# EAGLE board GSM Playground V1_6 (EAGLE 5.06)
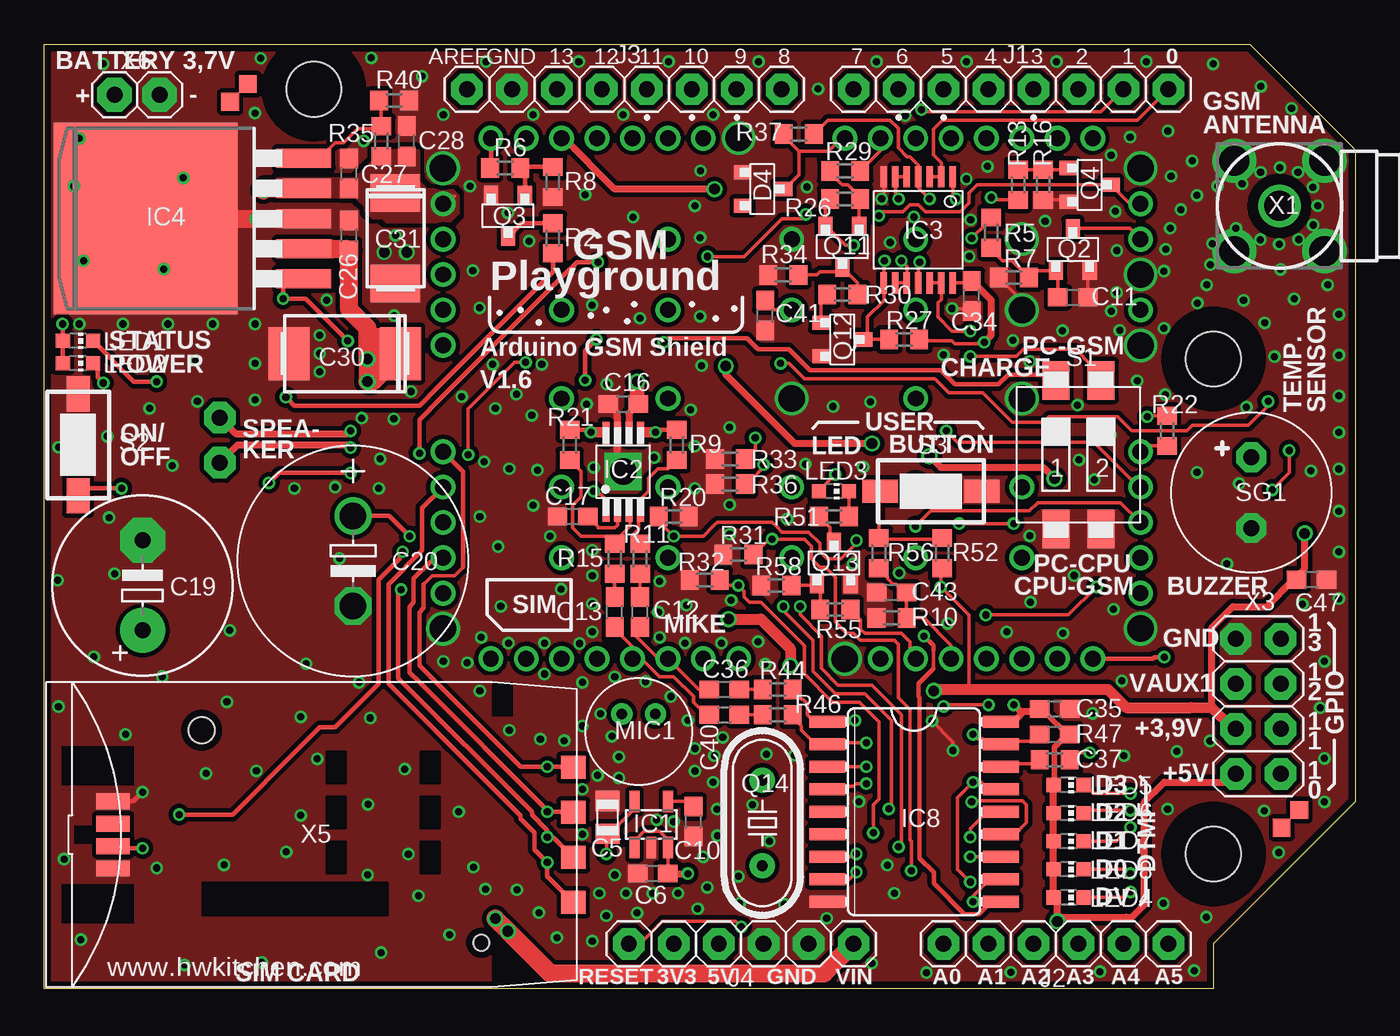
[diagram p1: board, top side]
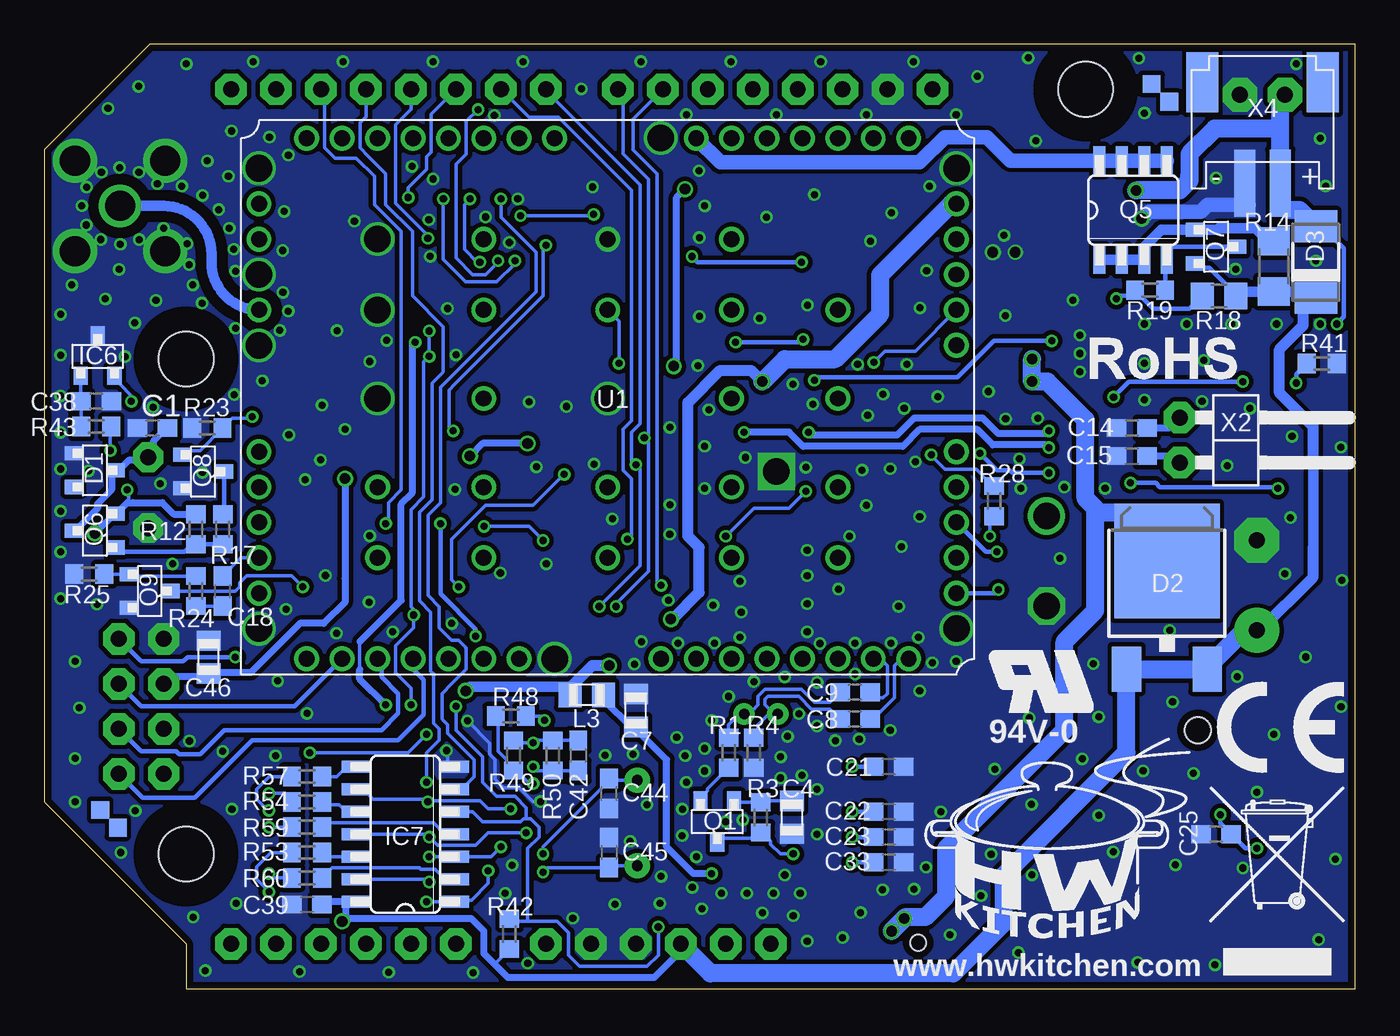
[diagram p2: board, bottom side, seen from below]

Size 74.06 x 53.34 mm. Coordinates in mm from the lower left corner, seen from the top.
Outline: 66.04,2.54 66.04,0 0,0 0,53.34 68.1,53.34 74.06,47.39 74.06,10.56 66.04,2.54
Copper layers (1*16): Top 0.035mm / dielectric 1.5mm / Bottom 0.035mm
Design rules "default *": minimum track width 0.15mm, minimum drill 0.3mm, track to track 0.185mm, track to pad 0.185mm, pad to pad 0.2mm, via to via 0.2mm, smd to smd 0.2mm, copper to edge 0.4mm, drill to drill 0.2mm, minimum pad ring 5mil, minimum via ring 5mil, stop-mask expansion 4mil, vias tented up to drill 2mm, thermal gap 10mil
Net classes: 1 power: width 0.61 mm, drill 0.508 mm, clearance 0.152 mm; 2 gnd: width 0.305 mm, drill 0.508 mm, clearance 0.152 mm; 3 usbvcc: width 0.508 mm, drill 0.508 mm, clearance 0.152 mm; 4 aref: width 0.406 mm
Holes 3.1 mm at 66.04,35.56 66.04,7.62 15.24,50.8
tRestrict: area 63.3,4.9 to 68.7,10.3; area 63.3,32.9 to 68.7,38.3; area 12.5,48.1 to 17.9,53.5; area 68.2,42.6 to 71.3,45.8
bRestrict: area 63.3,4.9 to 68.7,10.3; area 63.3,32.9 to 68.7,38.3; area 12.5,48.1 to 17.9,53.5; area 60.9,37.3 to 62.9,39.4; area 68.2,42.6 to 71.3,45.8; area 60.9,37.3 to 62.9,39.4; 4 lines

## Footprints (pad centres in the part's own frame; a part is rotated, then mirrored left to right if it is on the bottom)
C0603 = smd 1.1 x 1: 1 -0.85,0; 2 0.85,0
C0805 = smd 1.15 x 1.35: P$1 -0.925,0; P$4 0.925,0
E5-10,5 = drill 0.9 pad 2.54 round: + -2.54,0 | drill 0.9 pad 2.54 octagon: - 2.54,0
POLCAP0.22F = drill 1.5 pad 2.1 round: + -2.54,0 | drill 1.5 pad 2.1 octagon: - 2.54,0
CT_D = smd 2.3 x 3: + 3.15,0; - -3.15,0
CT_C = smd 2.1 x 2.8: + 2.55,0; - -2.55,0
SOT23_OO = smd 0.8 x 1: 1 -0.95,-1.2; 2 0.95,-1.2; 3 0,1.2
TO-252AA = smd 1.65 x 2.54: 1 -2.28,-4.8; 3 2.28,-4.8 | smd 5.97 x 6.48: 4 0,1.3
DO-214AC = smd 1.8 x 2.4: A 2.025,0; C -2.025,0
SOT23 = smd 1 x 0.8: 1 1.1,-0.95; 2 1.1,0.95; 3 -1.2,0
SOT23-5 = smd 0.55 x 1.2: 1 -0.95,-1.3; 2 0,-1.3; 3 0.95,-1.3; 4 0.95,1.3; 5 -0.95,1.3
MSOP8_H = smd 0.4 x 1.3: 1 -0.975,-2.175; 2 -0.325,-2.175; 3 0.325,-2.175; 4 0.975,-2.175; 5 0.975,2.175; 6 0.325,2.175; 7 -0.325,2.175; 8 -0.975,2.175 | drill 1.5 pad 2.1 square: 9 0,0
TSSOP14 = smd 0.36 x 1.2: 1 -1.95,-3; 2 -1.3,-3; 3 -0.65,-3; 4 0,-3; 5 0.65,-3; 6 1.3,-3; 7 1.95,-3; 8 1.95,3; 9 1.3,3; 10 0.65,3; 11 0,3; 12 -0.65,3; 13 -1.3,3; 14 -1.95,3
TO263-5 = smd 1.067 x 3.1: 1 -3.404,-8.231; 2 -1.702,-8.231; 3 0,-8.231; 4 1.702,-8.231; 5 3.404,-8.231 | smd 10.8 x 10.41: 6 0,0.7
SO14_O = smd 0.67 x 1.6: 1 -3.81,-2.8; 2 -2.54,-2.8; 3 -1.27,-2.8; 4 0,-2.8; 5 1.27,-2.8; 6 2.54,-2.8; 7 3.81,-2.8; 8 3.81,2.8; 9 2.54,2.8; 10 1.27,2.8; 11 0,2.8; 12 -1.27,2.8; 13 -2.54,2.8; 14 -3.81,2.8
SO18W = smd 0.66 x 2.032: 1 -5.08,-4.902; 2 -3.81,-4.902; 3 -2.54,-4.902; 4 -1.27,-4.902; 5 0,-4.902; 6 1.27,-4.902; 7 2.54,-4.902; 8 3.81,-4.902; 9 5.08,-4.902; 10 5.08,4.902; 11 3.81,4.902; 12 2.54,4.902; 13 1.27,4.902; 14 0,4.902; 15 -1.27,4.902; 16 -2.54,4.902; 17 -3.81,4.902; 18 -5.08,4.902
1X08 = drill 0.9 pad 1.778 octagon: 1 -8.89,0; 2 -6.35,0; 3 -3.81,0; 4 -1.27,0; 5 1.27,0; 6 3.81,0; 7 6.35,0; 8 8.89,0
1X06 = drill 0.9 pad 1.778 octagon: 1 -6.35,0; 2 -3.81,0; 3 -1.27,0; 4 1.27,0; 5 3.81,0; 6 6.35,0
JCI = smd 1.3 x 1.4: P$1 -0.95,0; P$4 0.95,0
CHIP-LED0603 = smd 0.8 x 0.8: A 0,-0.85; C 0,0.85
KECG2742PBL-A = drill 0.6 pad 1.2 round: + 1,-0.95; - 1,0.95
SOT23_O = smd 0.8 x 1: 1 -0.95,-1.2; 2 0.95,-1.2; 3 0,1.2
SO08 = smd 0.67 x 1.6: 1 -1.905,-2.8; 2 -0.635,-2.8; 3 0.635,-2.8; 4 1.905,-2.8; 5 1.905,2.8; 6 0.635,2.8; 7 -0.635,2.8; 8 -1.905,2.8
SOT23_0 = smd 0.8 x 1: 1 -0.95,-1.2; 2 0.95,-1.2; 3 0,1.2
HC49/S = drill 0.6 pad 1.422 round: 1 -2.413,0; 2 2.413,0
R0603 = smd 1 x 1.1: 1 -0.85,0; 2 0.85,0
R1206 = smd 1.6 x 1.803: 1 -1.422,0; 2 1.422,0
R0805 = smd 1.3 x 1.5: 1 -0.95,0; 2 0.95,0
SMS-002 = smd 1.52 x 2.16: 1 -1.27,-4.196; 2 1.27,-4.196; 3 1.27,4.196; 4 -1.27,4.196
P-DT2112C = smd 2 x 1.3: 1 -2.875,0; 2 2.875,0
LD-BZEN-0903 = drill 0.9 pad 1.676 octagon: + 0,2; - 0,-2
GE863-QUAD = drill 0.9 pad 1.4 round: 1 17,14.7; 2 15,14.7; 3 13,14.7; 4 11,14.7; 5 9,14.7; 6 7,14.7; 7 5,14.7; 9 -3,14.7; 10 -5,14.7; 11 -7,14.7; 12 -9,14.7; 13 -11,14.7; 14 -13,14.7; 15 -15,14.7; 16 -17,14.7; 18 -19.7,11; 19 -19.7,9; 20 -19.7,7; 21 -19.7,5; 22 -19.7,3; 23 -19.7,-3; 24 -19.7,-5; 25 -19.7,-7; 26 -19.7,-9; 27 -19.7,-11; 29 -17,-14.7; 30 -15,-14.7; 31 -13,-14.7; 32 -11,-14.7; 33 -9,-14.7; 34 -7,-14.7; 35 -5,-14.7; 37 3,-14.7; 38 5,-14.7; 39 7,-14.7; 40 9,-14.7; 41 11,-14.7; 42 13,-14.7; 43 15,-14.7; 44 17,-14.7; 46 19.7,-11; 47 19.7,-9; 49 19.7,-5; 51 19.7,3; 52 19.7,5; 53 19.7,7; 54 19.7,9; 55 19.7,11; 57 13,9; 58 7,9; 59 0,9; 60 -7,9; 61 -13,9; 62 13,5; 63 7,5; 64 0,5; 65 -7,5; 66 -13,5; 68 7,0; 70 -7,0; 71 -13,0; 73 7,-5; 74 0,-5; 75 -7,-5; 76 -13,-5; 78 7,-9; 79 0,-9; 80 -7,-9 | drill 1.5 pad 1.9 round: 8 3,14.7; 17 -19.7,13; 28 -19.7,-13; 36 -3,-14.7; 45 19.7,-13; 48 19.7,-7; 50 19.7,-3; 56 19.7,13; 67 13,0; 69 0,0; 72 13,-5; 77 13,-9
MARK = smd 1 x 1: P$1 0.5,0.5; P$2 -0.5,-0.5
SMA-H = drill 1.7 pad 2.4 round: 1 0,0 | drill 1.7 pad 2.5 round: 2 -2.55,2.55; 3 2.55,2.55; 4 2.55,-2.55; 5 -2.55,-2.55
1X02/90 = drill 0.9 pad 1.778 octagon: 1 -1.27,-3.81; 2 1.27,-3.81
2X04 = drill 0.9 pad 1.778 octagon: 1 -3.81,-1.27; 2 -3.81,1.27; 3 -1.27,-1.27; 4 -1.27,1.27; 5 1.27,-1.27; 6 1.27,1.27; 7 3.81,-1.27; 8 3.81,1.27
CON_BAT = smd 1.2 x 3.8: 1 -1,-4.2; 2 1,-4.2 | smd 1.8 x 3.4: NC1 -3.4,1.5; NC2 3.4,1.5
SIM_CARD_READER = smd 1.3 x 1.4: 1 -2.1,-21; 2 -4.64,-21; 3 -7.18,-21; 4 -9.72,-21 | smd 0.9 x 1.9: 5 -4,5; 6 -5.27,5; 7 -6.54,5; 8 -7.81,5 | hole 1.5: 0,0 | hole 0.9: -12,-15.8
1X02 = drill 0.9 pad 1.93 octagon: 1 -1.27,0; 2 1.27,0

## Placement (x,y rotation side)
C1  22pF/50V COG (0603) / Open Source  [C0603]  67.94,31.67 0 bottom
C4  10uF/6,3V X7R (0805) / Panasonic ECJ2FB0J106M  [C0805]  31.83,9.68 270 bottom
C5  10uF/6,3V X7R (0805) / Panasonic ECJ2FB0J106M  [C0805]  31.83,9.68 90 top
C6  100nF/16V X7R (0603) / Open Source  [C0603]  34.37,6.51 180 top
C7  10uF/6,3V X7R (0805) / Panasonic ECJ2FB0J106M  [C0805]  40.64,15.72 90 bottom
C8  220nF/10V X7R (0603) / Open Source  [C0603]  28.26,15.24 180 bottom
C9  220nF/10V X7R (0603) / Open Source  [C0603]  28.26,16.75 180 bottom
C10  10nF/50V X7R (0603) / Open Source  [C0603]  36.67,9.45 90 top
C11  100nF/16V X7R (0603) / Open Source  [C0603]  58.1,39.05 0 top
C12  220nF/10V X7R (0603) / Open Source  [C0603]  33.66,21.27 90 top
C13  220nF/10V X7R (0603) / Open Source  [C0603]  32.23,21.27 90 top
C14  22pF/50V COG (0603) / Open Source  [C0603]  12.62,31.67 0 bottom
C15  22pF/50V COG (0603) / Open Source  [C0603]  12.62,30.08 0 bottom
C16  220nF/10V X7R (0603) / Open Source  [C0603]  32.7,33.02 0 top
C17  220nF/10V X7R (0603) / Open Source  [C0603]  29.85,26.67 0 top
C18  100nF/16V X7R (0603) / Open Source  [C0603]  63.98,22.46 90 bottom
C19  1000uF/10V (E5-10,5x16) / EPCOC B41856A3108M000  [E5-10,5]  5.56,22.78 90 top
C20  0,22F/5,5V / Panasonic EECF5R5U224  [POLCAP0.22F]  17.45,24.16 270 top
C21  22pF/50V COG (0603) / Open Source  [C0603]  26.35,12.54 180 bottom
C22  22pF/50V COG (0603) / Open Source  [C0603]  26.35,10 180 bottom
C23  22pF/50V COG (0603) / Open Source  [C0603]  26.35,8.57 180 bottom
C25  22pF/50V COG (0603) / Open Source  [C0603]  7.86,8.73 180 bottom
C26  100nF/50V X7R (0603) / Open Source  [C0603]  17.22,42.55 90 top
C27  100nF/16V X7R (0603) / Open Source  [C0603]  17.22,46.04 90 top
C28  100nF/16V X7R (0603) / Open Source  [C0603]  20.48,47.86 90 top
C30  22uF/20V (D) / KEMET T491D226K020AT  [CT_D]  16.98,35.87 0 top
C31  100u/150mOhm/6,3V (C) / AVX  [CT_C]  19.84,42.39 90 top
C33  22pF/50V COG (0603) / Open Source  [C0603]  26.35,7.14 180 bottom
C34  10nF/50V X7R (0603) / Open Source  [C0603]  52.39,39.13 90 top
C35  100nF/16V X7R (0603) / Open Source  [C0603]  57.07,15.8 180 top
C36  100nF/16V X7R (0603) / Open Source  [C0603]  38.42,16.91 0 top
C37  100nF/16V X7R (0603) / Open Source  [C0603]  57.07,14.37 180 top
C38  220nF/10V X7R (0603) / Open Source  [C0603]  71.12,33.18 180 bottom
C39  10nF/50V X7R (0603) / Open Source  [C0603]  59.21,4.76 0 bottom
C40  100nF/16V X7R (0603) / Open Source  [C0603]  38.42,15.48 0 top
C41  220nF/10V X7R (0603) / Open Source  [C0603]  40.72,38.02 90 top
C42  180pF/50V COG (0603) / Open Source  [C0603]  43.89,13.18 270 bottom
C43  220nF/10V X7R (0603) / Open Source  [C0603]  47.86,22.38 0 top
C44  22pF/50V COG (0603) / Open Source  [C0603]  42.15,11.03 90 bottom
C45  22pF/50V COG (0603) / Open Source  [C0603]  42.15,7.7 270 bottom
C46  10uF/6,3V X7R (0805) / Panasonic ECJ2FB0J106M  [C0805]  64.77,18.73 90 bottom
C47  220nF/10V X7R (0603) / Open Source  [C0603]  71.6,23.1 180 top
D1  BAT54LT1 (SOT23) / ON / Farnell 1431113  [SOT23_OO]  71.2,29.29 270 bottom
D2  50WQ03FNPBF / Vishay // Farnell 9101292  [TO-252AA]  10.64,22.86 0 bottom
D3  CD214A-B140LF (SMA) / BOURNS // FARNELL 1612331  [DO-214AC]  2.22,41.04 90 bottom
D4  BZX84C3V3 (SOT23) / FAIRCHILD // Farnell 1651563  [SOT23]  40.56,45.16 180 top
IC1  TPS79330DBV (SOT23-5) / TI / Farnell 1287688  [SOT23-5]  34.29,9.29 0 top
IC2  TPA6203A1DGNR (MSOP8) / TI // FARNELL 1580362  [MSOP8_H]  32.7,29.21 0 top
IC3  SN74HC4066PW (TSSOP14) / TI  [TSSOP14]  49.37,42.86 180 top
IC4  MIC29302WU (TO263-5) / MICRELL // FARNELL 1100649  [TO263-5]  6.43,43.5 90 top
IC6  LM61BIM3 (SOT-23) / NATIONAL // FARNELL 1564759  [SOT23]  71.04,35.72 270 bottom
IC7  SN74AHC14D (SO14) / TI  [SO14_O]  53.66,8.73 90 bottom
IC8  HT9170D (SOP18) / HOLTEK // Farnell_1420879  [SO18W]  49.13,10 270 top
J1  SSA-108-W-T / SAMTEC  [1X08]  54.61,50.8 180 top
J2  SSA-106-W-T / SAMTEC  [1X06]  57.15,2.54 0 top
J3  SSA-108-W-T / SAMTEC  [1X08]  32.77,50.8 180 top
J4  SSA-106-W-T / SAMTEC  [1X06]  39.37,2.54 0 top
L3  MMZ2012Y202B (0805) / TDK  [JCI]  43.42,16.59 180 bottom
LED1  OF-SMD1608B_BLUE (0603) // TME  [CHIP-LED0603]  1.91,36.59 270 top
LED2  HCL-1904AYL_YELLOW (0603) // TME  [CHIP-LED0603]  1.91,35.33 270 top
LED3  OF-SMD1608B_BLUE (0603) // TME  [CHIP-LED0603]  44.61,28.1 270 top
LED4  HCL-1904AYL_YELLOW (0603) // TME  [CHIP-LED0603]  57.86,5.16 270 top
LED5  HCL-1903BG4_GREEN (0603) // TME  [CHIP-LED0603]  57.86,11.51 270 top
LED6  HCL-1903BG4_GREEN (0603) // TME  [CHIP-LED0603]  57.86,9.92 270 top
LED7  HCL-1903BG4_GREEN (0603) // TME  [CHIP-LED0603]  57.86,8.33 270 top
LED8  HCL-1903BG4_GREEN (0603) // TME  [CHIP-LED0603]  57.86,6.75 270 top
MIC1  KECG2742PBL-A / KINGSTATE // FARNELL 1502742  [KECG2742PBL-A]  33.58,14.53 90 top
Q1  BC817-25 (SOT23) / Open Source  [SOT23_O]  36.04,9.45 180 bottom
Q2  BC817-25 (SOT23) / Open Source  [SOT23_O]  58.1,41.75 0 top
Q3  BC817-25 (SOT23) / Open Source  [SOT23_O]  26.19,43.66 180 top
Q4  BC817-25 (SOT23) / Open Source  [SOT23_O]  59.05,45.4 270 top
Q5  IRF7424PBF (SO8) / IRF // FARNELL 9765786  [SO08]  12.54,43.97 0 bottom
Q6  BC807-25 (SOT23) / Open Source  [SOT23_0]  71.2,25.88 90 bottom
Q7  BC807-25 (SOT23) / Open Source  [SOT23_0]  7.86,41.91 270 bottom
Q8  BC817-25 (SOT23) / Open Source  [SOT23_O]  65.09,29.21 270 bottom
Q9  BC817-25 (SOT23) / Open Source  [SOT23_O]  68.1,22.46 270 bottom
Q11  BC807-25 (SOT23) / Open Source  [SOT23_0]  45.09,41.91 180 top
Q12  BC817-25 (SOT23) / Open Source  [SOT23_O]  45.08,36.67 270 top
Q13  BC817-25 (SOT23) / Open Source  [SOT23_O]  44.61,24.05 0 top
Q14  3,579545MHz (HC49-S) / SQ // TME  [HC49/S]  40.56,9.37 90 top
R1  1k 5% (0603) / Open Source  [R0603]  35.4,13.34 90 bottom
R2  470R 5% (0603) / Open Source  [R0603]  28.73,42.39 90 top
R3  10k 5% (0603) / Open Source  [R0603]  33.58,9.68 90 bottom
R4  1k 5% (0603) / Open Source  [R0603]  33.97,13.34 270 bottom
R5  10k 5% (0603) / Open Source  [R0603]  53.5,42.7 270 top
R6  10k 5% (0603) / Open Source  [R0603]  26.04,46.36 0 top
R7  47k 5% (0603) / Open Source  [R0603]  54.77,40.16 0 top
R8  47k 5% (0603) / Open Source  [R0603]  28.73,45.56 90 top
R9  62k 1% (0603) / Open Source  [R0603]  35.72,30.72 90 top
R10  300k 1% (0603) / Open Source  [R0603]  47.86,20.95 0 top
R11  15k 1% (0603) / Open Source  [R0603]  33.66,24.29 90 top
R12  4k7 5% (0603) / Open Source  [R0603]  65.48,25.96 90 bottom
R13  10k 5% (0603) / Open Source  [R0603]  55.01,45.4 90 top
R14  2R2 5% (1206) / Open Source  [R1206]  4.6,40.8 90 bottom
R15  15k 1% (0603) / Open Source  [R0603]  32.23,24.29 90 top
R16  47k 5% (0603) / Open Source  [R0603]  56.44,45.4 90 top
R17  1k 5% (0603) / Open Source  [R0603]  63.98,25.96 270 bottom
R18  10k 5% (0805) / Open Source  [R0805]  7.7,39.13 0 bottom
R19  300k 5% (0603) / Open Source  [R0603]  11.59,39.45 0 bottom
R20  4k7 5% (0603) / Open Source  [R0603]  35.56,26.67 180 top
R21  62k 1% (0603) / Open Source  [R0603]  29.69,30.72 270 top
R22  10k 5% (0603) / Open Source  [R0603]  63.42,31.51 270 top
R23  47k 5% (0603) / Open Source  [R0603]  64.85,31.67 0 bottom
R24  10k 5% (0603) / Open Source  [R0603]  65.48,22.46 270 bottom
R25  47k 5% (0603) / Open Source  [R0603]  71.52,23.42 0 bottom
R26  47k 5% (0603) / Open Source  [R0603]  45.24,44.61 180 top
R27  4k7 5% (0603) / Open Source  [R0603]  48.58,36.67 0 top
R28  4k7 5% (0603) / Open Source  [R0603]  20.4,27.54 90 bottom
R29  10k 5% (0603) / Open Source  [R0603]  45.24,46.2 180 top
R30  10k 5% (0603) / Open Source  [R0603]  45.09,39.21 180 top
R31  100k 5% (0603) / Open Source  [R0603]  39.21,24.53 180 top
R32  100k 5% (0603) / Open Source  [R0603]  37.31,23.1 180 top
R33  100k 5% (0603) / Open Source  [R0603]  38.74,29.92 180 top
R34  4k7 5% (0603) / Open Source  [R0603]  41.75,40.32 0 top
R35  22k 1% (0603) / Open Source  [R0603]  19.05,47.86 270 top
R36  100k 5% (0603) / Open Source  [R0603]  38.73,28.5 180 top
R37  1k 5% (0603) / Open Source  [R0603]  42.62,48.26 0 top
R40  10k 1% (0603) / Open Source  [R0603]  19.76,50.17 180 top
R41  470R 5% (0603) / Open Source  [R0603]  1.89,35.3 0 bottom
R42  47k 5% (0603) / Open Source  [R0603]  47.78,3.1 90 bottom
R43  4k7 5% (0603) / Open Source  [R0603]  71.12,31.75 0 bottom
R44  100k 1% (0603) / Open Source  [R0603]  41.43,16.91 0 top
R46  100k 1% (0603) / Open Source  [R0603]  41.43,15.48 0 top
R47  300k 1% (0603) / Open Source  [R0603]  57.07,12.94 0 top
R48  38k3, 1% (0603) / Open Source  [R0603]  47.7,15.4 180 bottom
R49  62k 1% (0603) / Open Source  [R0603]  47.55,13.18 270 bottom
R50  100k 1% (0603) / Open Source  [R0603]  45.32,13.18 270 bottom
R51  470R 5% (0603) / Open Source  [R0603]  44.61,26.67 180 top
R52  4k7 5% (0603) / Open Source  [R0603]  50.72,24.61 90 top
R53  470R 5% (0603) / Open Source  [R0603]  59.21,7.7 180 bottom
R54  470R 5% (0603) / Open Source  [R0603]  59.21,10.56 180 bottom
R55  10k 5% (0603) / Open Source  [R0603]  44.69,21.43 180 top
R56  47k 5% (0603) / Open Source  [R0603]  47.15,24.61 270 top
R57  470R 5% (0603) / Open Source  [R0603]  59.21,11.99 180 bottom
R58  47k 5% (0603) / Open Source  [R0603]  41.35,22.78 0 top
R59  470R 5% (0603) / Open Source  [R0603]  59.21,9.13 180 bottom
R60  470R 5% (0603) / Open Source  [R0603]  59.21,6.27 180 bottom
S1  ADF02STTR04 / TYCO  [SMS-002]  58.42,30.16 0 top
S2  P-DT2112C (SMD) / GME  [P-DT2112C]  1.91,30.72 90 top
S3  P-DT2112C (SMD) / GME  [P-DT2112C]  50.09,28.1 0 top
SG1  LD-BZEN-0903 / LOUDITY // TME  [LD-BZEN-0903]  68.18,28.02 0 top
U1  GE863-QUAD  [GE863-QUAD]  42.23,33.34 180 bottom
U$11  MARK  [MARK]  70.4,9.6 180 top
U$12  MARK  [MARK]  70.4,9.6 90 bottom
U$13  MARK  [MARK]  11,50.6 270 bottom
U$14  MARK  [MARK]  11,50.6 0 top
X1  SMA-H  [SMA-H]  69.77,44.21 0 top
X2  header 2pin_90deg_2,54mm / Open Source  [1X02/90]  6.11,30.99 270 bottom
X3  header 2x4pin_2,54mm / Open Source  [2X04]  68.58,15.95 90 top
X4  S2B-PH-SM4-TB(LF)(SN) / JST // FARNELL 9492615  [CON_BAT]  5.24,49.69 0 bottom
X5  FMS006Z-0000-BF / YAMAICHI // FARNELL 1143954  [SIM_CARD_READER]  8.89,14.61 90 top
X6  not mounted  [1X02]  5.24,50.48 0 top

## Tracks (layer width: path | path; a pad name or v marks a point on that pad's centre or on a via)
+3.9V  (via drill 0.4 pad 0.7, 0.6 pad 0.9)
  Top 0.2: 23.18,44.77 22.96,44.77 U1.27 | LED3.A 43.76,28.12 v44.69,29.05 | v70.33,30.4 70.33,29.13 v69.37,28.18 | v50.64,22.7 | 52.23,16.91 52.23,21.11 v50.64,22.7 | v50.64,22.7 50.64,23.68 R52.1
  Top 0.254: LED1.A 1.06,37.52 v1.03,37.54 | LED2.A 1.06,36.51
  Top 0.406: IC2.6 33.03,32.49 C16.2 | 65.96,15.88 65.96,20.4 67.15,21.59 69.06,21.59 70.56,23.1 | 70.56,23.1 C47.2 | 70.56,23.1 71.2,23.73 v71.2,25.72 | 1.06,36.51 LED1.A | 1.06,36.51
  Top 0.6: v50.24,16.83 50.32,16.91 | 64.77,15.88 65.96,15.88 | 65.96,15.88 | 65.96,15.88 67.07,14.76 67.23,14.76 X3.4
  Top 0.61: 60.56,16.43 | 60.56,16.43 61.12,15.88 64.77,15.88 | v38.66,20.88 40.48,20.88 42.15,19.21 v42.15,18.26 | v50.24,16.83 50.32,16.91 52.23,16.91 60.09,16.91 60.56,16.43
  Top 0.813: v33.5,34.29 33.5,33.08 C16.2
  Top 1.016: v12.38,45.09 12.5,45.2 IC4.4 | IC4.4 arc-44 IC4.4
  Bottom 0.2: v44.69,29.05 46.43,27.3 49.13,27.3 51.04,25.4 51.04,23.1 v50.64,22.7 | v70.33,30.4 70.33,31.69 R43.2 | 69.06,27.46 69.14,27.46 69.29,27.62 69.29,28.1 v69.37,28.18 | X4.2 4,45.49 3.89,45.38 | 44.53,16.67 44.45,16.67 L3.P$4
  Bottom 0.254: 3.81,43.97 3.81,45.38 3.89,45.38 | v1.03,37.54 0.64,37.94 0.64,41.83 1.43,42.62 1.78,42.62 D3.A | 44.53,16.67 44.77,16.91 44.77,16.99 44.69,17.07
  Bottom 0.305: 44.77,16.91 44.84,16.83
  Bottom 0.406: v71.2,25.72 70.09,26.83 Q6.2 69.36,27.46 69.06,27.46 67.39,27.46 66.73,26.81 R12.2 | 44.53,16.67
  Bottom 0.6: 44.29,17.07 44.69,17.07 50.01,17.07 v50.24,16.83
  Bottom 0.61: v33.5,34.29 34.13,34.92 35.88,34.92 37.7,33.1 37.7,25.56 37.07,24.92 37.07,22.38 38.58,20.88 v38.66,20.88 | v42.15,18.26 43.1,18.26 44.29,17.07
  Bottom 1.016: U1.27 22.81,44.34 26.83,40.32 26.83,38.1 29.37,35.56 32.23,35.56 v33.5,34.29 | 9.37,45.64 9.37,46.04 | 9.37,45.64 9.92,45.09 v12.38,45.09 | X4.2 4.24,48.58 | 4.24,48.58 4.24,50.21 X6.1 | 9.37,45.64 9.37,47.15 7.94,48.58 4.24,48.58 | 3.81,43.97 3.13,43.97 D3.A
  pour Top (isolate 0.254, no thermals): 13.18,45.72 17.62,45.72 18.65,46.75 18.65,47.31 21.11,47.31 21.11,45.56 21.59,45.09 23.02,45.09 23.34,44.77 23.34,43.82 22.86,43.34 21.43,43.34 21.43,43.34 19.37,43.34 19.13,43.58 18.57,43.58 18.18,43.97 18.18,44.21 17.62,44.77 13.18,44.77
+5V  (via drill 0.4 pad 0.7, 0.6 pad 0.9)
  Top 0.2: IC3.14 52.35,39.86 52.35,39.94 C34.2 52.47,39.9 52.49,39.9 | IC8.18 | 57.11,5.16 57.31,4.96 | 57.47,14.05 57.6,14.05 C37.1 57.78,14.37 | 56.67,15.48 56.54,15.48 C35.2 | 54.85,15.16 54.12,15.16 IC8.18 | LED8.A | LED5.A 57.06,11.55 57.07,11.55 | R27.2 49.53,36.67 | v53.1,36.51 53.02,36.43 51.44,36.43 51.28,36.59 49.51,36.59 R27.2 | R27.2 49.69,36.67 | LED7.A | LED6.A
  Top 0.254: 57.11,5.16 LED4.A 57.23,4.95
  Top 0.305: 57.07,11.55 57.07,13.65 57.47,14.05 | 57.78,14.37 56.67,15.48
  Top 0.406: 53.34,39.05 52.49,39.9 | 53.34,39.05 | 53.34,39.05 53.5,38.89 53.5,36.91 v53.1,36.51 | LED8.A LED7.A LED6.A LED5.A | LED4.A LED8.A | 57.23,4.95 v57.23,3.81 57.47,4.05 61.12,4.05 61.44,4.05 62.15,4.76 62.15,10.56 63.26,11.67 66.83,11.67 X3.2 | 55.32,15.64 54.85,15.16 | 55.32,15.64 56.06,15.64 C35.2 | 55.32,15.64 55.17,15.64 v54.77,16.03
  Bottom 0.2: R42.1 47.78,2.22 48.62,1.39 | 56.23,18.04 56.23,19.61
  Bottom 0.254: R18.2 6.75,39.21 8.26,40.72 8.57,40.72 8.81,40.96 Q7.2 | 2.94,39.38 2.59,39.38 D3.C
  Bottom 0.406: 57.07,3.97 49.93,3.97 49.21,3.25 49.21,1.98 48.62,1.39 47.86,0.64 39.61,0.64 38.1,2.14 J4.3 | 56.23,19.61 53.9,21.94 53.9,27.38 53.26,28.02 | v54.77,16.03 56.23,17.5 56.23,18.04 | 53.26,28.02 | C39.2 58.2,4.92 IC7.14 56.99,4.92 56.99,4.05 v57.23,3.81 | 53.26,28.02 53.26,36.35 v53.1,36.51
  Bottom 0.6: 57.07,3.97 v57.23,3.81 | 2.94,39.38 R14.1 | R14.1 6.5,39.38 R18.2 | 2.38,24.92 2.38,30.08 | R14.1 4.84,39.14
  Bottom 0.61: 2.38,24.92 2.38,23.26 5.4,20.24 C19.+ | 2.38,30.08 2.38,31.75 4.29,33.66 4.29,36.12 2.94,37.47 2.94,39.38
  Bottom 0.813: C19.+ 5.56,20.32
  Bottom 1.016: J4.3 36.43,0.87 22.7,0.87 19.84,3.73 19.84,6.43 12.92,13.36 D2.1 D2.3 8.36,18.16 6.27,20.24 C19.+ 5.71,20.08
/SHUTDOWN  (via drill 0.4 pad 0.7)
  Top 0.2: IC2.1 31.73,27.01 | 31.73,27.01 31.75,26.99 | 31.73,27.01 31.73,27.64 31.43,27.94 31.2,27.94 v31.04,28.1 | R20.2 34.71,26.41 v35.56,25.56 37.23,25.56 37.78,26.11 37.86,26.19 38.02,26.35 41.12,26.35 41.35,26.11 41.67,25.8 43.18,25.8 43.81,25.16 43.81,24.69 44.21,24.29 45.01,24.29 45.88,25.16 v45.88,25.32 | U1.53 60.8,27.46 56.12,27.46 55.64,26.99 50.09,26.99 v49.21,26.11
  Bottom 0.2: v31.04,28.1 31.99,27.15 33.97,27.15 v35.56,25.56 | v49.21,26.11 46.67,26.11 v45.88,25.32
ALARM
  Bottom 0.2: U1.54 62.95,24.34 C18.2
BUZZER
  Top 0.2: R22.2 62.25,30.66 U1.51
CHARGE
  Bottom 0.813: U1.35 35.86,46.67 24.61,46.67 23.18,48.1 20.8,48.1 19.47,46.77 Q5.8 Q5.7 Q5.6 Q5.5
DTMF_DATA0  (via drill 0.4 pad 0.7)
  Top 0.2: v52.47,4.92 52.47,5.24 53.18,5.95 53.34,6.11 53.96,6.11 IC8.11 | v48.97,6.67 48.97,8.33 48.9,8.41 48.9,15.8 48.24,16.45 48.24,19.47 48.02,19.68 46.12,19.68 45.72,20.08 45.32,20.08 44.69,20.72 44.69,23.26 44.13,23.81 43.81,23.81 43.34,24.29 43.34,25 42.94,25.4 v41.12,25.4 40.96,25.4 40.48,24.92 40.46,24.92 R31.1
  Bottom 0.2: 50.94,4.92 v52.47,4.92 | 50.94,4.92 IC7.1 50.78,5 50.56,5 49.93,5 48.97,5.95 v48.97,6.67 | 50.94,4.92 | J1.7 46.67,49.21 45.01,49.21 40.88,45.09 | v41.12,25.4 40.88,25.64 40.88,28.81 41.35,29.29 41.35,31.59 40.88,32.07 40.88,45.09 | 40.88,45.09
  Bottom 0.406: IC7.1 50.56,4.92 50.56,5
DTMF_DATA1  (via drill 0.4 pad 0.7)
  Top 0.2: 54.85,7.38 54.12,7.38 IC8.12 | IC8.12 | v52.31,7.46 IC8.12 | v42.7,21.59 42.7,21.11 43.89,19.92 43.89,18.1 44.85,17.14 46.75,17.14 48.26,15.64 48.42,15.48 48.42,8.18 v48.26,8.02 | R36.1 39.82,28.73 39.93,28.73 40.64,29.45 v40.64,29.61
  Bottom 0.2: 51.12,7.46 v52.31,7.46 | 51.12,7.46 IC7.3 | 51.12,7.46 | J1.8 45.72,50.72 40.4,45.4 40.4,31.91 40.88,31.43 40.88,29.84 v40.64,29.61 40.4,29.37 40.4,23.89 v42.7,21.59 | 51.12,7.46 48.82,7.46 v48.26,8.02 | v42.7,21.59
DTMF_DATA2  (via drill 0.4 pad 0.7)
  Top 0.2: IC8.13 54.12,8.65 54.77,8.65 55.48,9.37 55.48,10.4 55.24,10.64 52.47,10.64 v52.39,10.56 | v41.75,21.59 41.75,21.35 43.42,19.68 43.42,17.94 44.69,16.67 46.35,16.67 47.86,15.16 47.86,10.32 v47.7,10.16 | R33.1 40.16,30.5 v40.16,31.11
  Bottom 0.2: J3.1 41.35,50.5 41.35,47.15 39.93,45.72 39.93,31.35 v40.16,31.11 39.93,30.88 39.93,30.64 39.93,23.57 41.75,21.75 v41.75,21.59 | IC7.9 56.04,11.27 55.48,10.72 52.55,10.72 v52.39,10.56 52.31,10.64 49.45,10.64 48.97,10.16 v47.7,10.16 | v47.7,10.16
DTMF_DATA3  (via drill 0.4 pad 0.7)
  Top 0.2: 54.85,9.92 54.12,9.92 IC8.14 53.26,10 52.31,9.05 v52.31,8.57 | 42.94,17.78 42.94,19.37 | 46.28,15.95 46.04,16.19 44.53,16.19 42.94,17.78 | v46.83,8.81 46.83,10.4 47.15,10.72 47.15,15.08 46.28,15.95 | 42.94,17.78 | 46.28,15.95 | 42.94,19.37 | 42.94,19.37 40.48,21.83 39.85,21.83 39.53,22.15 39.53,22.46 v39.21,22.78 38.16,22.78 R32.1
  Bottom 0.2: v52.31,8.57 52.47,8.73 | v52.31,8.57 51.83,8.1 49.69,8.1 48.97,8.81 v46.83,8.81 | J3.2 40.8,49.12 40.8,47.39 39.45,46.04 39.45,23.02 v39.21,22.78 | IC7.11 52.31,8.73 v52.31,8.57
DTMF_ENABLE  (via drill 0.4 pad 0.7)
  Top 0.2: 50.22,18.09 50.22,19.12 | v51.67,26.27 v54.77,26.27
  Top 0.254: IC8.10 53.5,4.92 52.78,4.21 51.99,4.21 50.24,5.95 50.24,6.59 49.45,7.38 49.45,16.43 49.37,16.51 49.37,17.22 50.22,18.07 50.22,18.09 | 50.22,19.12 50.22,19.39 v49.69,19.92
  Bottom 0.2: J1.3 58.22,50.6 58.22,47.51 57.63,46.91 56.44,46.91 55.4,45.88 55.4,44.29 53.9,42.78 53.9,28.18 54.61,27.46 54.61,26.43 v54.77,26.27 | 51.67,22.3 51.67,22.38 | 51.67,22.38
  Bottom 0.254: v49.69,19.92 49.69,20.32 51.67,22.3 | 51.67,22.38 v51.67,26.27
DTMF_VALID  (via drill 0.4 pad 0.7)
  Top 0.2: 54.85,11.11 54.85,11.19 54.12,11.19 IC8.15 54.03,11.19 53.96,11.19 53.64,11.51 53.1,11.51 52.94,11.67 v52.47,11.67 51.59,10.79 51.59,6.75 v52.31,6.03
  Bottom 0.2: v52.47,11.67 52.47,13.34 51.75,14.05 51.75,14.68 52.07,15 52.07,17.78 52.23,17.94 52.23,21.27 52.86,21.91 52.86,26.91 52.15,27.62 52.15,34.21 51.59,34.77 | J1.4 55.88,49.23 56.22,48.9 56.22,47.49 55.72,46.99 | v52.31,6.03 52.47,6.19 IC7.13 | 51.59,34.77 | IC7.13 | IC7.13 | 51.59,34.77 51.51,34.85 51.51,37.39 53.26,39.13 53.26,42.78 54.77,44.29 54.77,46.04 54.85,46.12 | 55.72,46.99 | 54.85,46.12 55.72,46.99 | 54.85,46.12
EAR_HF+
  Top 0.2: 34.13,19.21 34.7,18.64 U1.11 36.96,16.91 C36.1 | 34.13,19.21 | 34.13,19.21 33.34,20 33.34,20.11 C12.1
EAR_HF-
  Top 0.2: C13.1 32.54,20.11 32.54,20 33.23,19.32 U1.12 33.75,18.64 34.77,17.62 35.56,17.62 36.67,16.51 36.67,16.19 37.39,15.48 C40.1
GE863_RESET
  Top 0.2: U1.47 61.31,42.95 Q2.3
GND  (via drill 0.4 pad 0.7, 0.6 pad 0.7, 0.6 pad 0.9)
  Top 0.2: IC3.7 47.42,44.72 v47.31,44.61 | v51.28,38.42 52.49,38.42 | R7.1 55.23,38.85 U1.72 | Q4.2 57.76,44.55 R16.1 | C11.2 58.95,40.45 Q2.2 | v51.34,13.46 51.34,13.94 v50.15,15.13
  Top 0.254: X5.5 5.03,10.61 5.54,11.11 v5.56,11.11
  Top 0.406: IC2.9 32.38,29.54 IC2.7 32.38,32.49 C16.1
  Top 1.016: 9.84,43.5 14.36,43.5
  Bottom 0.2: IC7.7 51.04,12.54 51.28,12.78 51.28,13.4 v51.34,13.46 | v46.02,10.57 46.45,10.57 47.23,11.35 48.1,11.35 48.58,11.83 48.58,12.94 48.82,13.18 | 48.82,13.18 | 48.82,13.18 48.9,13.26 48.9,13.88 v50.15,15.13
  Bottom 0.813: 6,44.29 8.33,44.29 8.73,43.9 11.67,43.9 v12.06,43.5
  other vias: 6.35,6.83 19.21,41.59 20.48,41.59 28.26,17.78 24.61,16.83 2.06,2.78 22.54,49.37 26.19,43.82 28.57,25.56 27.54,32.39 25.48,32.78 36.75,28.26 69.73,7.7 34.69,21.27 32.46,11.91 30.4,14.84 34.77,19.84 36.75,13.57 23.42,10 26.27,14.6 32.23,17.62 30.4,17.3 30.96,2.7 31.04,29.45 36.51,32.7 24.21,40.56 27.86,29.29 36.2,19.53 28.26,19.53 68.73,50.97 27.62,27.3 30.56,44.85 34.45,30 26.27,29.37 30.64,33.02 28.02,14.1 0.8,15.94 30.96,24.77 30.96,23.34 18.41,15.3 36.75,30.64 40.96,8.33 60.75,37.18 34.77,23.02 60.27,38.27 71.94,44.22 22.54,18.49 30.96,21.75 30.96,20.16 9.14,12.17 68.7,42.31 63.26,37.31 65.66,39.75 69.8,46.37 60.58,39.33 63.6,42.95 63.35,41.76 65.11,44.81 73.13,22.04 71.55,29.25 66.28,45.33 63.45,10.15 64.96,1.03 24.24,6.87 38.33,14.2 63.25,40.53 0.76,23.07 19.75,32.19 30.24,19.5 7.92,1.36 31.77,34.15 12.29,1.5 26.22,19.52 14.49,15.36 65.87,40.9 69.76,42.05 28.96,2.9 6.66,17.63 41.82,4.78 2.8,18.74 10.16,7 61.74,34.34 37.22,7.45 39.28,4.83 42.37,13.19 38.01,10.15 64.21,44 36.75,44.21 10.32,16.21 24.84,29.77 26.67,33.58 18.05,47.89 0.81,30.58 60.59,41.7 63.32,33.56 62.26,52.36 57.18,52.36 52.1,52.36 47.02,52.36 40.35,52.36 35.27,52.36 30.2,52.36 24.96,52.36 18.47,52.57 49.83,0.92 56.54,43.35 61.34,48.1 37.05,42.42 19.03,2.05 3.33,52.23 12.23,52.55 23.89,18.42 24.69,19.84 54.6,0.94 44.56,32.89 37.78,49.37 32.7,49.37 27.62,49.37 25.64,24.97 59.64,0.98 59.32,28.76 47.78,42.15 3.57,31.19 8.65,33.18 18.97,29.92 17.94,32.23 48.02,5.4 63.98,13.41 54.37,20.16 52.25,41.37 53.28,46.45 52.33,43.43 52.09,45.73 22.89,3.06 60.99,13.16 57.55,20.08 72.31,13.02 59.21,15.56 65.14,38.72 71.67,43.14 68.71,46.11 70.86,42.32 71.67,45.27 70.83,46.11 72.5,39.76 70.61,38.96 67.75,38.88 69.5,35.7 73.14,35.79 65.12,29.17 64.84,46.76 63.65,45.89 66.03,52.24 70.46,49.72 73.14,38.09 73.14,33.49 67.5,28.53 73.14,26.98 73.14,24.67 73.14,29.36 71.07,21.72 73.14,31.42 67.91,32.85 72.31,18.49 33.26,43.58 30.94,38.61 37.05,37.98 29.2,22.58 24.59,38.45 43.09,45.28 48.29,23.48 57.52,37.17 43,29.63 55.72,21.84 58.18,23.34 60.24,31.28 60.87,17.39 25.79,21.6 33.65,37.87 38.72,31.71 38.72,27.34 38.72,25.67 45.7,24 41.97,26.54 65.86,13.99 46.25,29.47 63.48,48.44 43.71,50.82 51.04,20.64 40.72,18.34 38.8,21.94 24.61,26.67 46.67,33.15 60.4,21.44 50.86,28.2 63.22,4.83 38.26,19.53 31.43,15.53 29.37,14.02 32.07,14.26 33.97,17.35 35.4,16.51 36.35,15.16 36.75,12.3 37.78,11.67 39.21,6.35 38.02,8.65 35.8,5.4 34.37,5.4 32.86,5.4 32.23,6.43 30.4,8.73 30.4,11.27 35.56,9.45 32.46,13.1 40.8,13.26 34.59,9.54 37.45,5.73 31.26,12.05 40.01,10.4 20.36,12.41 17.78,17.3 40.32,19.61 36.27,21.67 37.85,13.16 31.35,5.4 58.45,29.87 58.37,32.97 55.67,25.58 54.72,36.62 66.81,24 49.13,43.58 60.27,47.08 60.5,43.91 69.83,40.63 68.94,37.61 37.07,46.2 67.66,45.47 67.31,42.95 65.99,42.08 27.95,4.31 13.67,7.74 18.28,10.42 18.26,6.44 21.14,5.26 4.44,37.54 6.98,37.54 9.52,37.54 11.91,37.54 1.98,37.54 11.91,49.45 2.22,41.12 1.98,48.02 15.56,36.91 15.56,35.88 11.91,35.32 20.57,7.61 14.49,9.79 11.98,12.31 26.7,5.6 1.12,7.33 16.68,24.31 7.23,29.55 8.56,35.49 21.34,51.52 25.33,35.27 23.58,33.44 4.6,14.37 10.48,20.24 14.79,18.36 11.91,33.26 72.07,15.88 19.76,38.02 15.56,34.85 36.91,4.52 33.5,4.29 31.75,4.13 47.62,6.99 72.31,10.56 65.64,4.05 24.92,5.64 16.43,28.34 5.95,32.78 48.63,49.32 14.13,28.26 3.66,26.61 3.98,23.44 15.95,38.89 19.84,42.55 37.13,35.2 24.05,45.32 27.38,42.23 46.74,1.45 44.2,3.99 28.11,35.27 20.72,33.73 18.89,28.26 50.8,35.8 55.67,35.43 6.75,40.64 1.67,45.33 7.86,45.8 15.43,12.98 57.06,31.6 68.91,10.06
  pour Top (isolate 0.25, rank 2, no thermals): 0,0 66.04,0 66.04,2.54 74.06,10.56 74.06,47.39 68.1,53.34 0,53.34
  pour Bottom (isolate 0.25, rank 2, no thermals): 0,0 66.03,0 66.04,2.54 74.06,10.56 74.06,47.39 74.06,47.39 68.1,53.34 0,53.34
  pour Top (no thermals): 8.65,6.35 8.65,3.81 19.68,3.81 19.68,6.35 17.38,6.35 17.38,13.89 15.72,13.89 15.72,6.35
  pour Top (no thermals): 0.71,13.89 0.71,11.35 5.32,11.35 5.32,13.89
  pour Top (no thermals): 0.79,6.11 0.79,3.41 5.4,3.41 5.4,6.11
  pour Top (no thermals): 1.51,9.6 1.51,7.86 2.59,7.86 2.59,9.6
  pour Top (no thermals): 25,17.62 25,15.16 26.75,15.16 26.75,17.62
  pour Top (no thermals): 24.92,1.9 24.92,0.48 26.43,0.48 26.43,1.9
  pour Top (no thermals): 20.88,14.05 20.88,6.19 22.62,6.19 22.85,13.15 21.9,14.1 21.59,14.05
GSM_ON/OFF  (via drill 0.4 pad 0.7)
  Top 0.2: R13.1 53.63,44.55 v53.5,44.69
  Bottom 0.2: J1.6 52.22,49.38 52.22,47.24 52.39,47.07 52.47,46.99 52.47,46.28 53.5,45.24 v53.5,44.69
GSM_RESET  (via drill 0.4 pad 0.7)
  Top 0.2: v52.39,42.39 53.24,43.24 53.24,43.29 R5.1
  Bottom 0.2: J1.5 53.34,49.68 54.22,48.8 54.22,44.37 53.02,43.17 52.4,42.55 52.39,42.55 v52.39,42.39 v52.4,42.39
MIC_HF+
  Bottom 0.2: U1.15 26.81,18.64 26.43,18.26 26.43,16.67 26.67,16.43 27.09,16.43 C9.1
MIC_HF-
  Bottom 0.2: U1.16 25.65,18.64 26.04,18.26 26.04,16.43 26.91,15.56 27.09,15.56 C8.1
N$1
  Bottom 0.2: IC7.12 58.13,7.46 R53.1
N$2
  Top 0.2: C11.1 57.25,40.45 Q2.1 56.01,40.55 R7.2 54.67,41.12 54.13,41.12 53.71,41.54 53.71,41.64 R5.2
N$3
  Top 0.2: 57.76,46.25 Q4.1 57.85,46.25 56.36,46.25 | 56.36,46.25 R13.2 | 56.36,46.25 R16.2
N$4
  Top 0.2: R29.2 44.39,46.09 44.93,45.56 | 44.93,45.56 | 44.93,45.56 45.09,45.4 45.4,45.4 45.72,45.09 45.72,44.98 R26.1 46.03,44.55 Q11.1
N$5
  Top 0.2: R34.2 43.66,40.32 43.81,40.48 44.86,40.48 Q11.3 45.94,39.86 R30.1
N$6
  Top 0.2: Q12.1 43.88,38.86 R30.2
N$7  (via drill 0.4 pad 0.7)
  Top 0.2: Q12.3 | R27.1 Q12.3 | R27.1 | v47.47,41.12 47.42,41.07 IC3.8 47.42,38.85 46.51,37.94 46.51,36.9 Q12.3 | IC3.1 51.32,44.8 v51.51,44.61
  Bottom 0.2: v51.51,44.61 51.51,41.2 50.24,39.93 48.5,39.93 47.47,40.96 v47.47,41.12
N$8  (via drill 0.4 pad 0.7)
  Top 0.2: IC1.1 33.34,8.34 33.89,8.89 34.77,8.89 35.16,8.49 35.16,8.06 IC1.3 35.24,6.53 C6.1
  Top 0.406: v36.35,6.51 | C6.1 v36.35,6.51
  Bottom 0.2: 40.96,14.95 40.8,14.95 C7.P$1 | 40.64,14.63 C7.P$1 | C7.P$1
  Bottom 0.406: v36.35,6.51 37.39,6.51 38.89,8.02 38.89,12.94 40.48,14.53 40.48,14.63 40.64,14.63 | L3.P$1 42.55,16.59 42.23,16.27 42.23,16.11 41.06,14.95 40.96,14.95
N$9
  Top 0.254: 28.7,46.41 R8.2 26.94,46.41 R6.2 27.15,46.09 Q3.1
N$10  (via drill 0.4 pad 0.7)
  Top 0.2: v23.95,30.16 23.95,32.77 26.56,35.37 v27.19,35.37
  Bottom 0.2: v23.95,30.16 23.95,30.12 23.18,29.35 21.41,29.35 20.8,28.73 20.74,28.73 R28.2 | U1.24 24.86,36.01 26.56,36.01 v27.19,35.37
N$11  (via drill 0.4 pad 0.7)
  Top 0.2: 50.02,44.62 v50.01,44.61 49.37,45.24 IC3.4 49.37,46.51 48.9,46.99 48.74,46.99 48.24,47.49 48.24,48.6 47.78,49.05 44.27,49.05 R37.2 | IC3.11 49.37,40.96 v49.45,41.04 | R37.2 | R37.2 43.42,48.26 43.34,48.18 43.18,48.18 43.1,48.18 43.08,48.16
  Bottom 0.2: v49.45,41.04 49.61,41.04 50.32,41.75 50.32,44.29 v50.01,44.61
N$12  (via drill 0.4 pad 0.7)
  Top 0.254: C20.+ 19.49,26.7 v20.64,25.56
  Bottom 0.2: v20.64,25.56 20.64,26.45 R28.1
N$13  (via drill 0.4 pad 0.7)
  Top 0.254: LED2.C 2.76,35.26 3.02,35.01 3.02,34.53 v3.33,34.21
  Bottom 0.254: v3.33,34.21 | v3.33,34.21 3.33,34.71 R41.1
N$14
  Bottom 0.6: X1.1 | X1.1 67.31,44.21 arc90 64.61,41.51 64.61,41.02 arc-90 U1.49
N$15  (via drill 0.4 pad 0.7)
  Top 0.2: 32.54,9.37 31.94,8.76 C5.P$1 31.75,8.68 v31.75,7.62 | 32.54,9.37 | 32.54,9.37 33.26,10.08 33.26,10.51 IC1.5
  Bottom 0.2: R3.1 33.12,8.83 | R3.1 33.24,8.49 33.18,8.49 33.02,8.33 33.02,8.18 32.46,7.62 v31.75,7.62 | Q1.3 36.04,8.49 33.97,8.49 33.97,8.83 R3.1
N$16  (via drill 0.4 pad 0.7)
  Top 0.254: R2.1 28.73,40.48 22.23,33.97 21.19,32.94 14.13,32.94 13.81,33.26 | 5.32,34.29 v6.35,34.29 5.06,34.29 LED1.C | v13.65,33.42 13.81,33.26 | 13.81,33.26
  Top 0.406: 2.86,36.67 2.84,36.67 LED1.C
  Bottom 0.254: v6.35,34.29 12.78,34.29 v13.65,33.42
N$17
  Top 0.2: IC4.5 15.22,46.9 arc45 15.24,46.91 15.43,46.91 arc45 15.65,47 16.43,47.78 16.91,47.78 17.7,48.58 19.03,48.58 19.03,49.73
  Top 0.254: R40.2 18.91,49.85 19.03,49.73
  Top 0.406: 19.03,48.58 19.05,48.58 R35.1
N$18  (via drill 0.4 pad 0.7)
  Top 0.2: 23.65,23.81 23.18,23.34 21.91,23.34 21.51,22.94 | 21.51,22.94 | 21.43,22.86 21.51,22.94
  Top 0.254: X5.1 29.85,12.54 v28.42,12.54 26.91,12.54 26.75,12.7 21.19,18.26 21.19,21.27 21.43,21.51 21.43,22.86 | U1.22 23.65,29.21 23.65,23.81
  Bottom 0.254: C21.2 v28.42,12.54
N$19  (via drill 0.4 pad 0.7)
  Top 0.254: v28.42,10 29.85,10 X5.2 | v28.42,10 | v28.42,10 28.42,10.08 21.19,17.3 20.64,17.86 20.64,21.59 20.88,21.83 20.88,23.18 21.83,24.13 22.32,24.13 U1.19
  Bottom 0.254: C22.2 v28.42,10 | v28.42,10
N$20  (via drill 0.4 pad 0.7)
  Top 0.254: v20.16,22.54 20,22.38 20,17.54 27.54,10 27.54,9.84 28.42,8.97 v28.42,8.57 28.74,8.57 X5.3
  Bottom 0.254: U1.18 20.36,22.34 v20.16,22.54 | C23.2 v28.42,8.57
N$21  (via drill 0.4 pad 0.7)
  Top 0.254: X5.7 3.92,8.1 4.08,7.94 v5.56,7.94 | 18.89,23.02 18.89,17.22 16.43,14.76 15.56,14.76 14.37,13.57 10.64,9.84 v7.62,9.84 | v20.24,24.69 20.08,24.53 20.08,24.29 18.89,23.1 18.89,23.02 | 18.89,23.02
  Bottom 0.254: v20.24,24.69 20.88,24.69 U1.20 | v5.56,7.94 6.21,7.94 C25.1 7.62,9.34 v7.62,9.84
N$22  (via drill 0.4 pad 0.7)
  Top 0.254: U1.21 21.35,27.16 21.35,24.77 19.45,22.86 19.45,17.23 26.91,9.76 26.91,9.6 27.7,8.81 27.7,7.86 v28.42,7.14 28.42,6.35 X5.4
  Bottom 0.254: C33.2 v28.42,7.14
N$23
  Top 0.254: Q3.3 26.97,43.24 R2.2
N$24
  Bottom 0.2: C4.P$1 33.5,10.61 R3.2 34.97,10.53 Q1.1
N$27
  Bottom 0.2: C9.2 29.13,16.75 29.69,16.19 30.56,16.19 31.27,16.91 33.34,16.91 33.73,16.51 33.73,16.03 33.81,15.95 | 33.81,15.95 | 33.81,15.95 33.97,15.8 34.26,15.8 MIC1.+ 34.8,15.53 35.4,14.92 R1.2 | R1.2
N$28
  Bottom 0.2: C8.2 29.13,15.24 29.69,15.8 30.72,15.8 31.43,16.51 33.18,16.51 33.34,16.35 33.34,16.03 33.1,15.8 32.9,15.8 MIC1.- 33.13,15.53 33.73,14.92 33.73,14.42 R4.1
N$29
  Bottom 0.2: Q1.2 36.75,10.87 36.75,11.03 36.59,11.19 36.59,11.29 R1.1
N$31
  Top 0.2: IC2.2 32.38,26.19 32.23,26.04 31.27,26.04 31.27,26.09 C17.2
N$32
  Top 0.2: IC1.4 36.38,10.59 C10.2
N$33  (via drill 0.4 pad 0.7)
  Top 0.254: R21.1 30.74,31.57 v30.88,31.43 | 31.58,31.43 31.73,31.43 IC2.8
  Top 0.406: X2.1 10.82,31.35 17.14,31.35 v17.3,31.51
  Top 0.6: v30.88,31.43 31.58,31.43 31.59,31.43
  Bottom 0.406: v30.88,31.43 30.72,31.27 25.88,31.27 24.92,32.23 21.03,32.23 20.32,31.51 20.16,31.35 17.46,31.35 v17.3,31.51 | C14.2 10.51,31.67 X2.1
N$34
  Bottom 0.406: Q6.3 72.31,25.88 71.04,27.15 71.04,27.38 70.25,28.18 70.25,29.29 D1.3 69.85,29.29 69.29,29.84 68.36,29.84 SG1.+ 67.87,30.34 67.87,30.96 67.09,31.73 C1.2
N$35  (via drill 0.4 pad 0.7)
  Top 0.2: R22.1 62.31,32.36 v62.31,32.31
  Bottom 0.2: Q8.1 66.29,30.4 65.25,30.4 64,31.65 R23.2 63.44,32.23 62.39,32.23 v62.31,32.31
N$36  (via drill 0.4 pad 0.7)
  Top 0.2: IC2.5 34.53,31.39 v34.53,31.43
  Top 0.254: R9.2 34.66,31.57 v34.53,31.43
  Top 0.406: X2.2 10.92,30.72 17.14,30.72 v17.3,30.56
  Top 0.6: v34.53,31.43 33.83,31.43
  Bottom 0.406: v34.53,31.43 31.99,31.43 31.19,30.64 25.56,30.64 24.61,31.59 21.35,31.59 20.48,30.72 17.46,30.72 v17.3,30.56 | C15.2 10.28,30.08 X2.2
N$37
  Bottom 0.2: IC7.10 56.99,10 57.39,10.4 58.2,10.4 R54.1
N$38
  Bottom 0.2: R24.1 69.2,23.31 Q9.1 R25.2
N$39
  Bottom 0.2: C18.1 R24.2 | C18.1
N$40
  Top 0.2: R9.1 35.72,29.84 35.24,29.37 34.66,29.37 34.13,28.84 34.13,28.1 33.68,27.64 IC2.4 33.68,26.53 33.58,26.43 33.58,25.96 33.26,25.64 33.26,25.56 33.66,25.16 R11.2
N$41
  Top 0.2: R15.2 32.23,25.24 | R15.2 32.17,25.14 31.91,25.4 31.91,25.08 | 32.23,25.24 31.91,25.56 30.32,25.56 29.84,26.04 29.84,27.3 30.32,27.78 30.32,29.23 R21.2 | R15.2 32.23,25.24 | 32.23,25.24 33.1,26.11 33.1,27.06 33.03,27.06 IC2.3
N$42  (via drill 0.4 pad 0.7)
  Top 0.2: v46.43,13.89 44.31,13.89 IC8.2 43.99,14.05 43.34,14.05 42.78,14.61 42.78,14.84 42.28,15.34 R46.2
  Bottom 0.2: R49.1 47.41,13.89 v46.43,13.89 46.3,14.03 C42.1 R50.1
N$43
  Top 0.2: R55.2 43.84,22.85 Q13.1 43.59,22.78 R58.2
N$44
  Top 0.2: C12.2 R11.1
N$45
  Top 0.2: C13.2 R15.1 | R15.1
N$46  (via drill 0.4 pad 0.7)
  Top 0.2: IC8.3 | v46.43,12.54 IC8.3
  Bottom 0.2: R50.2 C42.2 46.22,12.33 v46.43,12.54
N$47  (via drill 0.4 pad 0.7)
  Top 0.2: v45.8,15.16 45.64,15 44.31,15 IC8.1 44.15,15.16 43.5,15.16 43.34,15.32 43.26,15.32 43.1,15.48 43.1,16.11 42.86,16.35 42.78,16.35 42.28,16.85 R44.2
  Bottom 0.2: R48.1 46.04,15.4 v45.8,15.16
N$48
  Top 0.2: C36.2 R44.1 | R44.1
N$49
  Top 0.2: C40.2 R46.1 | R46.1
N$50  (via drill 0.4 pad 0.7)
  Top 0.2: IC8.4 44.39,11.43 45.72,11.43 45.88,11.59 v46.43,11.59
  Bottom 0.2: v46.43,11.59 46.65,11.59 47.39,12.33 R49.2 47.94,12.72 47.94,12.94 48.42,13.41 48.42,15.26 R48.2
N$51
  Bottom 0.2: R57.1 57.55,11.99 57.15,12.38 56.7,12.38 56.54,12.54 IC7.8
N$52
  Top 0.2: IC8.16 54.61,12.54 54.77,12.7 55.98,12.7 R47.1
N$53  (via drill 0.4 pad 0.7)
  Top 0.2: C37.2 55.82,13.97 54.93,13.97 54.77,13.81 IC8.17 53.34,13.81 53.02,14.13 52.7,14.13 v52.47,14.37 | R47.2 57.94,12.94 58.34,13.34 v59.05,13.34
  Bottom 0.2: v59.05,13.34 53.5,13.34 v52.47,14.37
N$54  (via drill 0.4 pad 0.7)
  Top 0.2: 45.48,7.46 IC8.7 | v45.88,7.62 45.72,7.46 45.48,7.46 | v45.88,7.62 | 45.48,7.46
  Bottom 0.2: Q14.2 42.17,11.78 | 42.23,11.67 45.88,8.02 v45.88,7.62
  Bottom 0.254: 42.17,11.78 42.17,11.83
  Bottom 0.406: 42.17,11.83 42.17,11.88 C44.2 42.23,11.88 42.23,11.67
N$55  (via drill 0.4 pad 0.7)
  Top 0.2: IC8.8 45.48,6.19 v45.88,6.59
  Bottom 0.2: Q14.1 42.17,6.95 42.23,6.9 | v45.88,6.59 45.62,6.85 C45.2
  Bottom 0.406: C45.2 42.15,6.9 42.23,6.9
N$56
  Bottom 0.2: IC7.4 51.44,8.73 52.07,9.37 58.36,9.37 R59.1
N$57
  Bottom 0.2: IC7.2 51.44,6.19 51.99,6.75 52.78,6.75 52.86,6.83 57.78,6.83 58.34,6.27 R60.1
N$58  (via drill 0.4 pad 0.7)
  Top 0.2: LED4.C 61.04,5.16 v61.36,5.48
  Bottom 0.2: R53.2 61.28,7.7 62.07,6.91 62.07,6.19 v61.36,5.48
N$59  (via drill 0.4 pad 0.7)
  Top 0.2: LED5.C 58.77,11.51 59.25,11.03 v61.36,11.03 | v61.36,11.03
  Bottom 0.2: v61.36,11.03 60.46,11.03 60.46,10.95 R54.2
N$60  (via drill 0.4 pad 0.7)
  Top 0.2: v61.36,10.08 58.77,10.08 58.72,10.02 LED6.C
  Bottom 0.2: R57.2 61.36,11.99 62.07,11.27 62.07,10.72 | v61.36,10.08 61.44,10.08 62.07,10.72 | 62.07,10.72
N$61  (via drill 0.4 pad 0.7)
  Top 0.2: LED7.C 60.41,8.34 60.4,8.33 60.56,8.33 v61.36,9.13
  Bottom 0.2: R59.2 v61.36,9.13 | v61.36,9.13
N$62  (via drill 0.4 pad 0.7)
  Top 0.2: LED8.C 61.12,6.75 v61.36,6.51
  Bottom 0.2: R60.2 61.12,6.27 v61.36,6.51
N$67
  Bottom 0.6: R14.2 4.92,42.22 5.64,42.94 7.7,42.94 7.78,42.86 Q7.1 10.96,42.86 11.91,41.91 Q5.3 | Q5.3 | Q5.3 Q5.2 Q5.1
N$68
  Bottom 0.254: Q8.3 63.89,26.89 R17.1
N$69
  Bottom 0.254: Q7.3 10.4,41.91 10.56,41.75 10.56,41.25 Q5.4 10.64,40.72 10.72,40.64 10.72,39.47 R19.2
N$70
  Bottom 0.2: R12.1 65.51,25.08 65.72,25.08
  Bottom 0.254: R12.1 R17.2 | Q6.1 69.77,24.93 69.53,24.69 66.12,24.69 65.72,25.08
N$74
  Top 0.2: R51.1 | R51.1 LED3.C
N$75
  Top 0.2: R51.2 44.37,26.06 44.37,25.8 44.61,25.56 Q13.3
N$77
  Bottom 0.2: R43.1 | R43.1 C38.2 71.99,33.2 IC6.1
N$78
  Top 0.2: S3.1 47.15,28.04 R56.1 47.23,25.46 47.28,25.4 50.48,25.4 50.6,25.28 | 50.6,25.28 50.66,25.22 | R52.2 50.72,25.4 50.6,25.28
N$79  (via drill 0.4 pad 0.7)
  Top 0.2: C41.2 41.25,38.34 U1.74 | v41.59,35.32 42.07,35.32 42.94,34.45 50.32,34.45 51.12,33.66 53.02,33.66 54.69,31.99 56.44,31.99 56.75,32.31 60.64,32.31 61.44,31.51 64.53,31.51 64.85,31.83 68.02,31.83 69.14,32.94 v69.14,33.18
  Bottom 0.2: v41.59,35.32 41.59,37.7 U1.74 | v69.14,33.18 69.14,33.5 69.77,34.13 | 69.77,34.13 | 69.77,34.13 69.85,34.21 69.85,34.38 IC6.2
ON/OFF  (via drill 0.4 pad 0.7)
  Top 0.2: U1.46 61.32,44.34 Q4.3 52.7,45.4 52.23,44.93 | 49.53,44.13 49.37,44.29 48.9,44.29 48.5,43.89 47.39,43.89 v47.15,43.66 | 49.53,44.13 | 49.53,44.13 49.77,43.89 51.75,43.89 52.23,44.37 | 52.23,44.37 52.23,44.93 | 52.23,44.93 | 52.23,44.37 | S2.1 2.13,27.84 2.54,28.26 | v37.47,41.35 39.53,41.35 41.67,43.5 42.78,43.5 v43.02,43.74
  Top 0.254: 22.38,33.34 29.37,40.32 30.08,41.04 v31.27,41.04 | 22.38,33.34 | 2.54,28.23 2.54,28.26 v4.37,28.26 | v12.7,28.57 13.26,29.13 v17.3,29.13 | v21.19,30.24 21.19,32.15 22.38,33.34
  Bottom 0.2: v47.15,43.66 43.1,43.66 v43.02,43.74
  Bottom 0.254: v37.47,41.35 37.15,41.04 v31.27,41.04 | v4.37,28.26 4.45,28.34 11.03,28.34 11.27,28.57 v12.7,28.57 | v17.3,29.13 19.37,29.13 19.53,29.29 20.24,29.29 v21.19,30.24
POWER/CHARGE  (via drill 0.4 pad 0.7)
  Top 0.2: 14.68,40.07 IC4.1 13.73,40.08 | 56.53,33.73 S1.4 57.15,34.45 56.83,34.45 56.59,34.69
  Top 0.254: 56.59,34.69 54.45,34.69 53.9,34.13 51.44,34.13 50.64,34.92 43.26,34.92 42.07,36.12 40.32,36.12 39.69,36.75 35.24,36.75 v35,36.51 | v30.56,34.37 30.56,36.04 v31.19,36.67 | 13.73,40.08 13.49,39.85 v13.49,38.97 14.76,38.97 v17.14,36.59
  Bottom 0.2: R19.1 12.44,39.23 12.54,39.13
  Bottom 0.254: R18.1 9.37,38.42 11.41,38.42 R19.1 | v30.56,34.37 30.4,34.53 22.46,34.53 21.99,35.01 | v35,36.51 31.35,36.51 v31.19,36.67 | 12.54,39.13 13.34,39.13 v13.49,38.97 | 21.99,35.01 21.99,35 | 21.99,35.01 20.4,36.59 v17.14,36.59
PWRMON  (via drill 0.4 pad 0.7)
  Top 0.2: R26.2 44.13,44.35 Q11.2 45.26,41.99 v45.72,41.99 | U1.52 61.83,28.34 59.29,30.88 51.59,30.88 v50.96,31.51 | v50.96,31.51
  Bottom 0.2: v45.72,41.99 45.88,41.83 45.88,39.13 50.88,34.13 51.2,33.81 51.2,31.75 v50.96,31.51
RESET  (via drill 0.4 pad 0.7)
  Top 0.2: IC3.12 IC3.13 50.67,38.92 50.48,38.73 50.48,37.94 51.28,37.15 v52.31,37.15 | v50.8,15.95 50.88,16.03 v53.34,16.03 | 59.69,34.61 S1.3 59.13,34.91 59.13,35.24 58.26,36.12 | J4.1 33.66,2.54 34.92,3.81 39.05,3.81 v39.37,3.49 | v53.18,21.11 57.86,21.11 v59.45,22.7 | v53.34,16.03 | v52.31,35.72 54.93,35.72 55.32,36.12 58.26,36.12 | 58.26,36.12
  Bottom 0.2: v53.18,21.11 53.18,21.19 | 50.64,10 IC7.5 49.85,10 49.29,9.45 47.15,9.45 46.99,9.6 46.83,9.6 | v53.18,21.11 53.18,20.4 54.21,19.37 54.21,17.86 53.34,16.99 v53.34,16.03 | 46.75,3.81 47.65,3.81 R42.2 | 46.75,3.81 46.75,7.94 46.12,8.57 46.12,9.13 46.59,9.6 46.83,9.6 | v53.18,21.11 53.18,21.43 53.34,21.59 53.34,27.07 52.63,27.78 52.63,35.4 v52.31,35.72 v52.31,37.15 | 46.75,3.81 45.09,3.81 44.45,3.17 44.45,1.91 43.81,1.27 40.01,1.27 39.37,1.91 v39.37,3.49 | Q9.3 63.26,22.46 63.02,22.7 63.02,22.94 62.63,23.34 60.09,23.34 v59.45,22.7 | Q9.3 | 50.32,14.13 49.29,13.1 49.29,11.67 48.5,10.87 47.47,10.87 46.83,10.24 46.83,9.6 | 50.32,14.13 | 50.32,14.13 50.8,14.61 v50.8,15.95
RX_CPU/TX_PC
  Top 0.2: J1.1 61.75,49.05 50.72,49.05 50.22,48.55 50.22,47.1 50.67,46.64 IC3.2 IC3.3
RX_GSM
  Top 0.2: 41.77,48.24 R37.1 42.07,47.97 42.07,47.86 42.62,47.31 | U1.37 45.02,48.04 44.29,47.31 42.62,47.31 | D4.3 41.83,45.16 42.62,45.96 42.62,47.31
SDASDS  (via drill 0.4 pad 0.7)
  Top 0.2: IC3.5 IC3.6 48.07,44.8 v48.26,44.61
  Bottom 0.2: v48.26,44.61 48.26,43.58 46.28,41.59 46.28,39.37 49.21,36.43 51.67,33.97 51.67,27.46 52.39,26.75 52.39,22.23 51.75,21.59 51.75,20.4 51.04,19.68 50.64,19.68 50.24,19.29 50.24,19.27 50.22,19.25 50.22,18.04 50.56,17.7 51.04,17.22 51.59,16.67 51.59,15.24 51.51,15.16 | IC7.6 50.48,11.27 49.77,11.99 49.77,12.94 51.28,14.45 51.28,14.92 51.51,15.16 | 51.51,15.16
STATUS_LED
  Top 0.254: R6.1 25.23,46.4 U1.29
TX_CPU/RX_PC  (via drill 0.4 pad 0.7)
  Top 0.2: J1.2 59.69,49.53 49.67,49.53 v49.55,49.65 | IC3.9 IC3.10 48.72,40.81 v48.42,41.12
  Bottom 0.2: v48.42,41.12 48.42,41.04 49.13,40.32 49.85,40.32 50.8,41.27 50.8,46.55 50.22,47.14 50.22,48.99 v49.55,49.65
TX_GSM
  Top 0.2: U1.38 47.23,47.33 R29.1
USER_BUTTON
  Top 0.2: U1.5 51.23,19.42 49.69,20.95 R10.2 C43.2 | C43.2 48.58,22.38 48.1,22.86 47.94,22.86 47.62,23.18 47.62,23.28 R56.2 | C43.2
USER_GPIO10
  Bottom 0.254: X3.1 68.5,10.79 65.56,10.79 62.31,14.05 54.05,14.05 53.42,14.68 52.63,15.48 52.63,17.46 53.18,18.02 53.18,18.59 U1.4
USER_GPIO11
  Bottom 0.254: X3.3 68.58,13.41 66.6,13.41 66.44,13.26 65.25,13.26 63.9,14.61 55.01,14.61 54.05,15.56 54.05,16.67 55.01,17.62 55.01,18.42 U1.3
USER_GPIO12
  Bottom 0.254: X3.5 68.58,15.95 59.91,15.95 U1.2
USER_GPIO13  (via drill 0.4 pad 0.7)
  Top 0.254: U1.1 62.61,18.64 62.71,18.73 v63.26,18.73
  Bottom 0.254: X3.7 68.58,18.49 66.2,18.49 65.96,18.73 v63.26,18.73
USER_LED
  Top 0.2: 45.48,21.43 R55.1 46.12,20.85 46.12,20.56 46.12,20.32 46.35,20.08 48.42,20.08 48.9,19.61 48.9,18.97 U1.6
VAUX1  (via drill 0.6 pad 0.9)
  Top 0.406: U1.31 29.35,48.04 32.23,45.16 v37.86,45.16 | v38.5,35.16 38.5,34.69 42.39,30.8 v46.75,30.8 | v57.07,28.81 56.44,29.45 50.64,29.45 v50.01,30.08
  Bottom 0.254: 64.96,17.46 64.77,17.46 C46.P$1
  Bottom 0.406: v37.86,45.16 38.34,44.69 38.34,35.32 v38.5,35.16 | v37.86,45.16 | C46.P$1 64.72,17.86 62.39,17.86 59.61,20.64 58.26,20.64 57.07,21.83 57.07,23.18 v57.07,28.81 | 64.96,17.46 65.11,17.62 66.91,17.62 X3.6 | v46.75,30.8 49.29,30.8 v50.01,30.08
VIN  (via drill 0.6 pad 0.9)
  Top 1.016: J4.6 44.05,0.87 28.57,0.87 v26.19,3.25 v25.48,3.97 | C30.+ 18.55,34.29 v18.26,34.29 18.26,35.4 | v18.26,35.56 18.26,36.83 | 18.26,35.4 v18.26,35.56 | 17.22,38.34 18.26,37.31 18.26,36.83 | 18.26,36.83 | 18.26,36.83 19.61,36.83 | v18.26,35.56 | v18.26,35.56 18.89,36.2 18.89,35.48 18.34,35.48 18.26,35.4 | 17.22,38.34 | 17.22,38.34 C26.1 17.17,41.75 16.27,41.75 16.23,41.8 IC4.2
  Bottom 0.61: 25.4,4.05 v25.48,3.97 | 25.4,4.05
  Bottom 1.016: v26.19,3.25 25.4,4.05 24.29,4.05 23.1,5.24 23.1,7.94 16.43,14.61 16.43,19.61 15.24,20.8 | 15.24,20.8 | 15.24,20.8 14.84,21.19 | 14.84,21.19 | 14.84,21.19 14.68,21.35 14.68,26.91 | v18.26,35.56 | v18.26,35.56 v18.26,34.29 17.38,34.29 15.24,32.15 15.24,27.7 14.68,27.15 14.68,26.91 | 14.68,26.91 12.62,26.91 12.54,26.83 12.54,26.07 D2.4

## Text on the board
tNames: www.hwkitchen.com
Reference: C8 | R7 | R5 | R6 | R4 | C3 | C2 | R9 | R8 | R1 | R2 | C1 | C4 | C5 | X2 | C7 | C6
_tsilk: AREF | GND | 13 | 12 | 11 | 10 | 9 | 8 | 7 | 6 | 5 | 4 | 3 | 2 | 1 | 0 | BATTERY 3,7V | + | - | GSM | ANTENNA | GSM | Playground | STATUS | Arduino GSM Shield | PC-GSM | POWER | CHARGE | V1.6 | TEMP. | SENSOR | USER | ON/ | SPEA- | OFF | KER | LED | BUTTON | PC-CPU | CPU-GSM | BUZZER | SIM | MIKE | 1 | GND | 3 | VAUX1 | 1 | 2 | 1 | +3,9V | GPIO | 1 | +5V | 1 | D3 | 0 | D2 | D1 | DTMF | D0 | DV | SIM CARD | RESET | 3V3 | 5V | GND | VIN | A0 | A1 | A2 | A3 | A4 | A5
_bsilk: 94V-0 | www.hwkitchen.com